# Altium schematic sheet ANALOG_HC_OVERCURRENT_REDUCNDANCY.SchDoc
size B
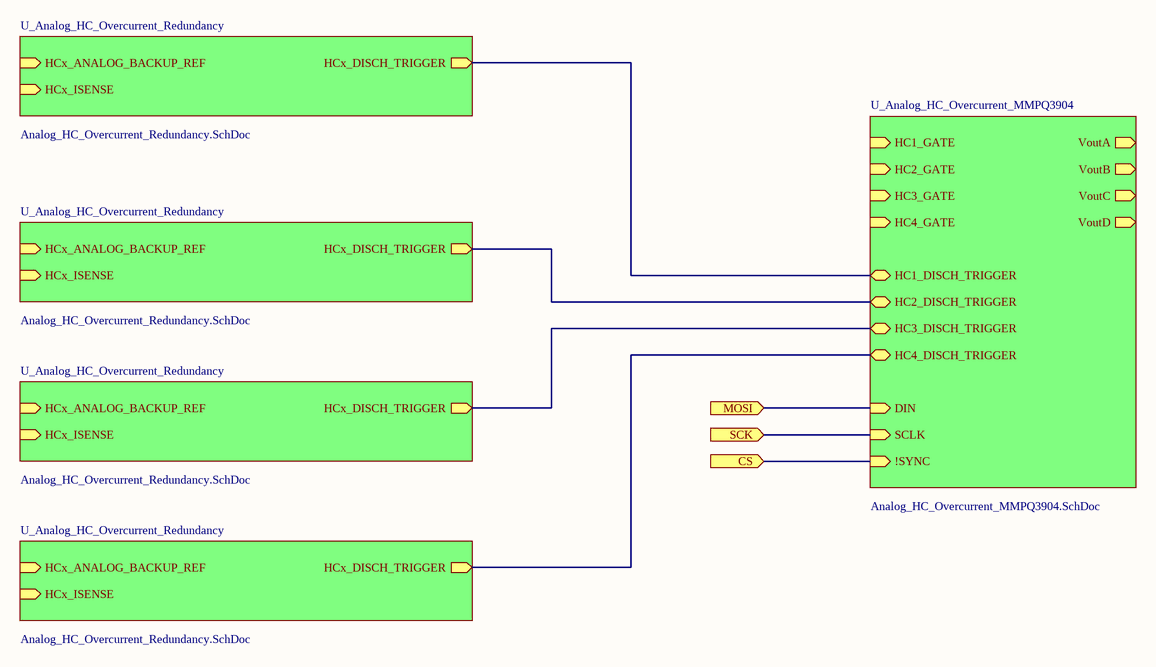
[diagram p0: ANALOG_HC_OVERCURRENT_REDUCNDANCY.SchDoc]

## Sub-sheets
U_Analog_HC_Overcurrent_MMPQ3904 = Analog_HC_Overcurrent_MMPQ3904.SchDoc: HC1_GATE (in), HC2_GATE (in), HC3_GATE (in), HC4_GATE (in), HC2_DISCH_TRIGGER (bidir), HC1_DISCH_TRIGGER (bidir), HC3_DISCH_TRIGGER (bidir), HC4_DISCH_TRIGGER (bidir), VoutA (out), VoutB (out), VoutC (out), VoutD (out), DIN (in), SCLK (in), !SYNC (in)
U_Analog_HC_Overcurrent_Redundancy = Analog_HC_Overcurrent_Redundancy.SchDoc: HCx_DISCH_TRIGGER (out), HCx_ANALOG_BACKUP_REF (in), HCx_ISENSE (in)
U_Analog_HC_Overcurrent_Redundancy = Analog_HC_Overcurrent_Redundancy.SchDoc: HCx_DISCH_TRIGGER (out), HCx_ANALOG_BACKUP_REF (in), HCx_ISENSE (in)
U_Analog_HC_Overcurrent_Redundancy = Analog_HC_Overcurrent_Redundancy.SchDoc: HCx_DISCH_TRIGGER (out), HCx_ANALOG_BACKUP_REF (in), HCx_ISENSE (in)
U_Analog_HC_Overcurrent_Redundancy = Analog_HC_Overcurrent_Redundancy.SchDoc: HCx_DISCH_TRIGGER (out), HCx_ANALOG_BACKUP_REF (in), HCx_ISENSE (in)

## Ports
CS (in), MOSI (in), SCK (in)

## Nets
CS: port CS, sheet U_Analog_HC_Overcurrent_MMPQ3904/!SYNC
MOSI: port MOSI, sheet U_Analog_HC_Overcurrent_MMPQ3904/DIN
SCK: port SCK, sheet U_Analog_HC_Overcurrent_MMPQ3904/SCLK
(unnamed): sheet U_Analog_HC_Overcurrent_MMPQ3904/HC2_DISCH_TRIGGER, sheet U_Analog_HC_Overcurrent_Redundancy/HCx_DISCH_TRIGGER
(unnamed): sheet U_Analog_HC_Overcurrent_MMPQ3904/HC1_DISCH_TRIGGER, sheet U_Analog_HC_Overcurrent_Redundancy/HCx_DISCH_TRIGGER
(unnamed): sheet U_Analog_HC_Overcurrent_MMPQ3904/HC3_DISCH_TRIGGER, sheet U_Analog_HC_Overcurrent_Redundancy/HCx_DISCH_TRIGGER
(unnamed): sheet U_Analog_HC_Overcurrent_MMPQ3904/HC4_DISCH_TRIGGER, sheet U_Analog_HC_Overcurrent_Redundancy/HCx_DISCH_TRIGGER